# EAGLE schematic Seeeduino_Mega-shield (EAGLE 7.5.0)
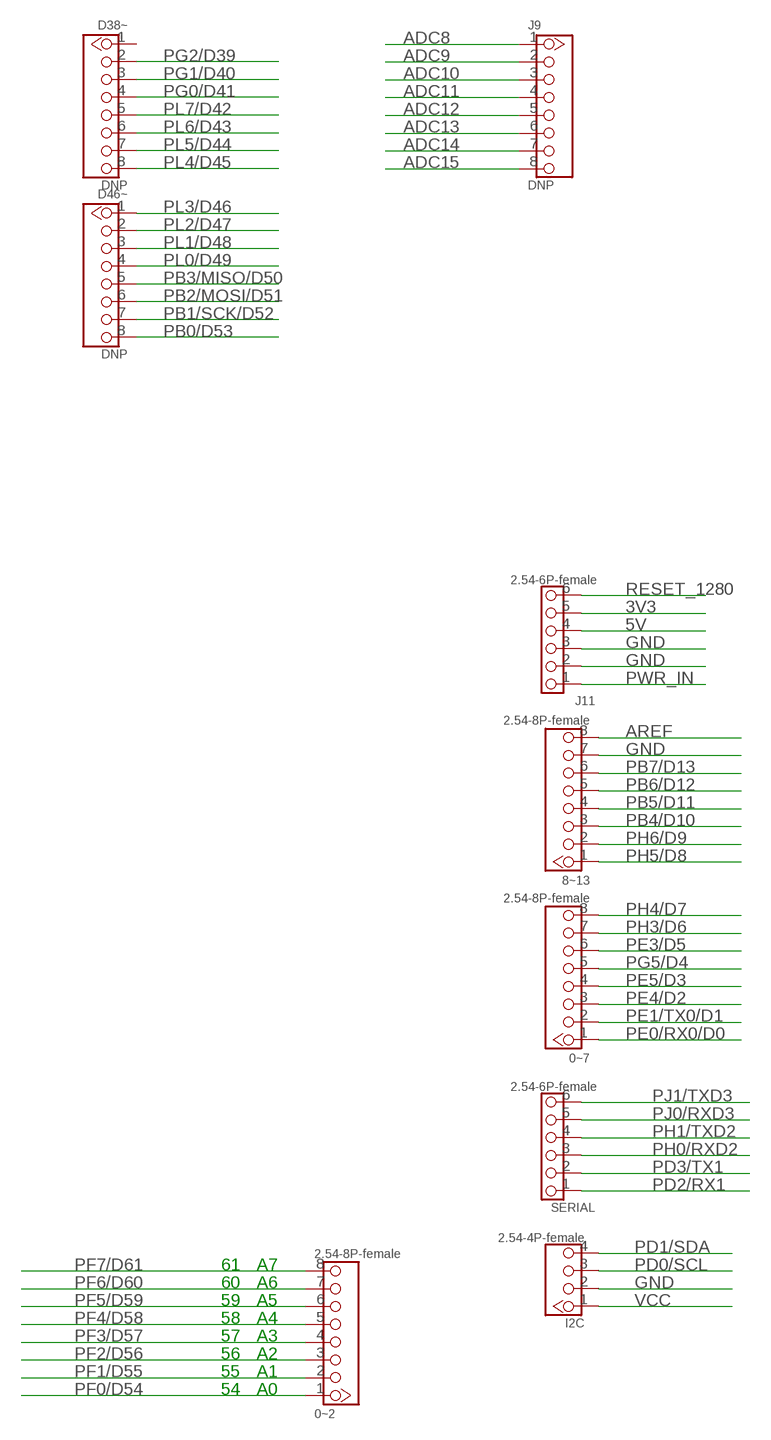
[diagram p0: schematic, sheet 1]

## Parts
0~2  2.54-8P-female  HEADER-8P-60/35MIL  [8P-2.54-60/35MIL]
0~7  2.54-8P-female  HEADER-8P-60/35MIL  [8P-2.54-60/35MIL]
8~13  2.54-8P-female  HEADER-8P-60/35MIL  [8P-2.54-60/35MIL]
D38~  DNP  HEADER-8P-60/35MIL  [8P-2.54-60/35MIL]
D46~  DNP  HEADER-8P-60/35MIL  [8P-2.54-60/35MIL]
I2C  2.54-4P-female  HEADER-4P-60/35MIL  [4P-60/35MIL]
J9  DNP  HEADER-8P-60/35MIL  [8P-2.54-60/35MIL]
J11  2.54-6P-female  HEADER-6P-60/35MIL  [6P-2.54-60/35MIL]
SERIAL  2.54-6P-female  HEADER-6P-60/35MIL  [6P-2.54-60/35MIL]

## Nets
3V3: J11.5
5V [vcc]: J11.4
ADC8: J9.1
ADC9: J9.2
ADC10: J9.3
ADC11: J9.4
ADC12: J9.5
ADC13: J9.6
ADC14: J9.7
ADC15: J9.8
AREF: 8~13.8
GND: 8~13.7 I2C.2 J11.2 J11.3
PB0/D53: D46~.8
PB1/SCK/D52: D46~.7
PB2/MOSI/D51: D46~.6
PB3/MISO/D50: D46~.5
PB4/D10: 8~13.3
PB5/D11: 8~13.4
PB6/D12: 8~13.5
PB7/D13: 8~13.6
PD0/SCL: I2C.3
PD1/SDA: I2C.4
PD2/RX1: SERIAL.1
PD3/TX1: SERIAL.2
PE0/RX0/D0: 0~7.1
PE1/TX0/D1: 0~7.2
PE3/D5: 0~7.6
PE4/D2: 0~7.3
PE5/D3: 0~7.4
PF0/D54: 0~2.1
PF1/D55: 0~2.2
PF2/D56: 0~2.3
PF3/D57: 0~2.4
PF4/D58: 0~2.5
PF5/D59: 0~2.6
PF6/D60: 0~2.7
PF7/D61: 0~2.8
PG0/D41: D38~.4
PG1/D40: D38~.3
PG2/D39: D38~.2
PG5/D4: 0~7.5
PH0/RXD2: SERIAL.3
PH1/TXD2: SERIAL.4
PH3/D6: 0~7.7
PH4/D7: 0~7.8
PH5/D8: 8~13.1
PH6/D9: 8~13.2
PJ0/RXD3: SERIAL.5
PJ1/TXD3: SERIAL.6
PL0/D49: D46~.4
PL1/D48: D46~.3
PL2/D47: D46~.2
PL3/D46: D46~.1
PL4/D45: D38~.8
PL5/D44: D38~.7
PL6/D43: D38~.6
PL7/D42: D38~.5
PWR_IN: J11.1
RESET_1280: J11.6
VCC: I2C.1
Unconnected: D38~.1

## Notes on the sheet
- 61 | A7
- 60 | A6
- 59 | A5
- 58 | A4
- 57 | A3
- 56 | A2
- 55 | A1
- 54 | A0

## Library data of the parts
0~2 0~7 8~13 D38~ D46~ J9 = Connector:HEADER-8P
I2C = Connector:HEADER-4P
J11 SERIAL = Connector:HEADER-6P

## Net classes
0 default: width 0.152 mm, drill 0.305 mm, clearance 0.152 mm
3 vcc: width 0.152 mm, drill 0.305 mm, clearance 0.152 mm